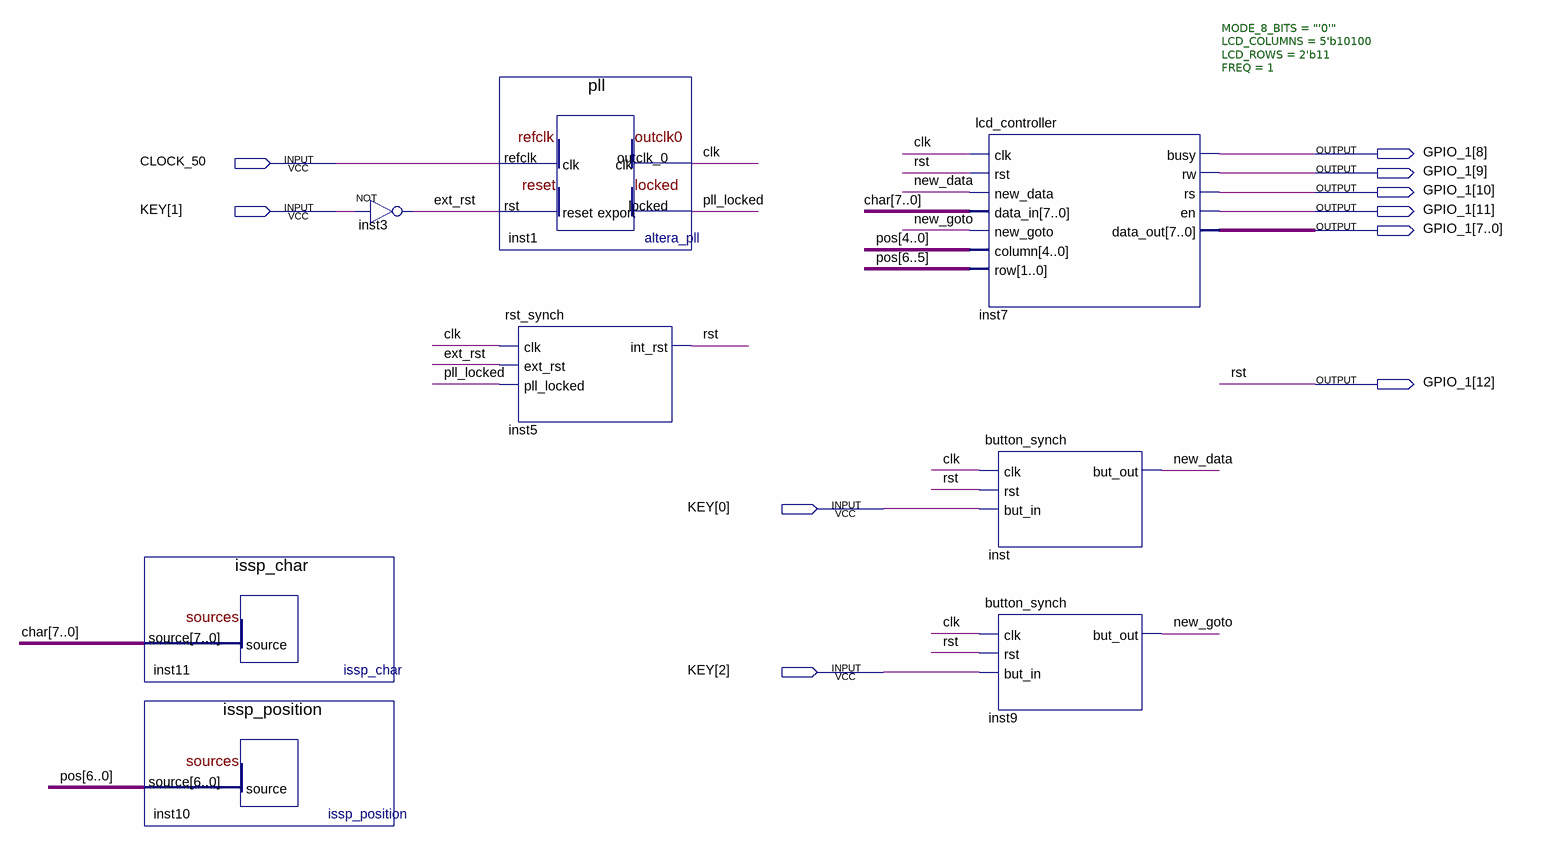
[diagram p0: schematic sheet]
// Quartus schematic lcd_driver_top.bdf as structural Verilog: 8 symbols, 10 pins
module lcd_driver_top (
  input  CLOCK_50,
  input  [2:0] KEY,
  output [12:0] GPIO_1
);

  wire clk, ext_rst, new_data, new_goto, pll_locked;
  wire [6:0] pos;
  wire [7:0] char;

  issp_char inst11 (.source(char));
  issp_position inst10 (.source(pos));
  not inst3 (ext_rst, KEY[1]);
  pll inst1 (.refclk(CLOCK_50), .rst(ext_rst), .outclk_0(clk), .locked(pll_locked));
  rst_synch inst5 (.clk(clk), .ext_rst(ext_rst), .pll_locked(pll_locked), .int_rst(GPIO_1[12]));
  lcd_controller #(.MODE_8_BITS("'0'"), .LCD_COLUMNS(5'b10100), .LCD_ROWS(2'b11), .FREQ(1)) inst7 (
    .clk(clk), .rst(GPIO_1[12]), .new_data(new_data), .data_in(char), .new_goto(new_goto), .column(pos[4:0]),
    .row(pos[6:5]), .busy(GPIO_1[8]), .rw(GPIO_1[9]), .rs(GPIO_1[10]), .en(GPIO_1[11]), .data_out(GPIO_1[7:0]));
  button_synch inst (.clk(clk), .rst(GPIO_1[12]), .but_in(KEY[0]), .but_out(new_data));
  button_synch inst9 (.clk(clk), .rst(GPIO_1[12]), .but_in(KEY[2]), .but_out(new_goto));

  // Other names for the same wires on the sheet: rst = GPIO_1[12]
endmodule
